# Altium schematic sheet InkJetFin - Kinen Port.SchDoc
size A
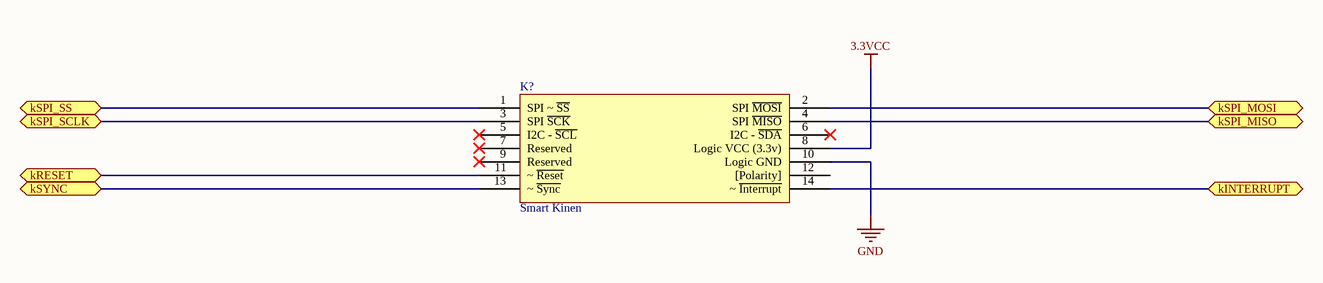
[diagram p0: InkJetFin - Kinen Port.SchDoc]

## Parts
K?  Smart Kinen  [Kinen Port - Device]

## Ports
kINTERRUPT, kRESET, kSPI_MISO, kSPI_MOSI, kSPI_SCLK, kSPI_SS, kSYNC

## Nets
3.3VCC: K?.8(Logic_VCC_(3.3v))
GND: K?.10(Logic_GND)
kINTERRUPT: K?.14(~_~{Interrupt}) ; port kINTERRUPT
kRESET: K?.11(~_~{Reset}) ; port kRESET
kSPI_MISO: K?.4(SPI_~{MISO}) ; port kSPI_MISO
kSPI_MOSI: K?.2(SPI_~{MOSI}) ; port kSPI_MOSI
kSPI_SCLK: K?.3(SPI_~{SCK}) ; port kSPI_SCLK
kSPI_SS: K?.1(SPI_~_~{SS}) ; port kSPI_SS
kSYNC: K?.13(~_~{Sync}) ; port kSYNC

Not connected (* = marked no-connect by the designer): K? 5(I2C_-_~{SCL})* 6(I2C_-_~{SDA})* 7(Reserved)* 9(Reserved)* 12([Polarity])

## Library data of the parts
K? = Kinen Device NEW Smart